# EasyEDA Pro project aoa_locator.eprj

# Schematic Schematic1

## Sheets
1 P1: Board Name: Board1; Create Date: 2025-01-06; Page Name: P1; Project Name: aoa_locator; Schematic Name: Schematic1; Update Date: 2025-02-27; Company: 嘉立创EDA; Page Size: A4; Version: V1.0
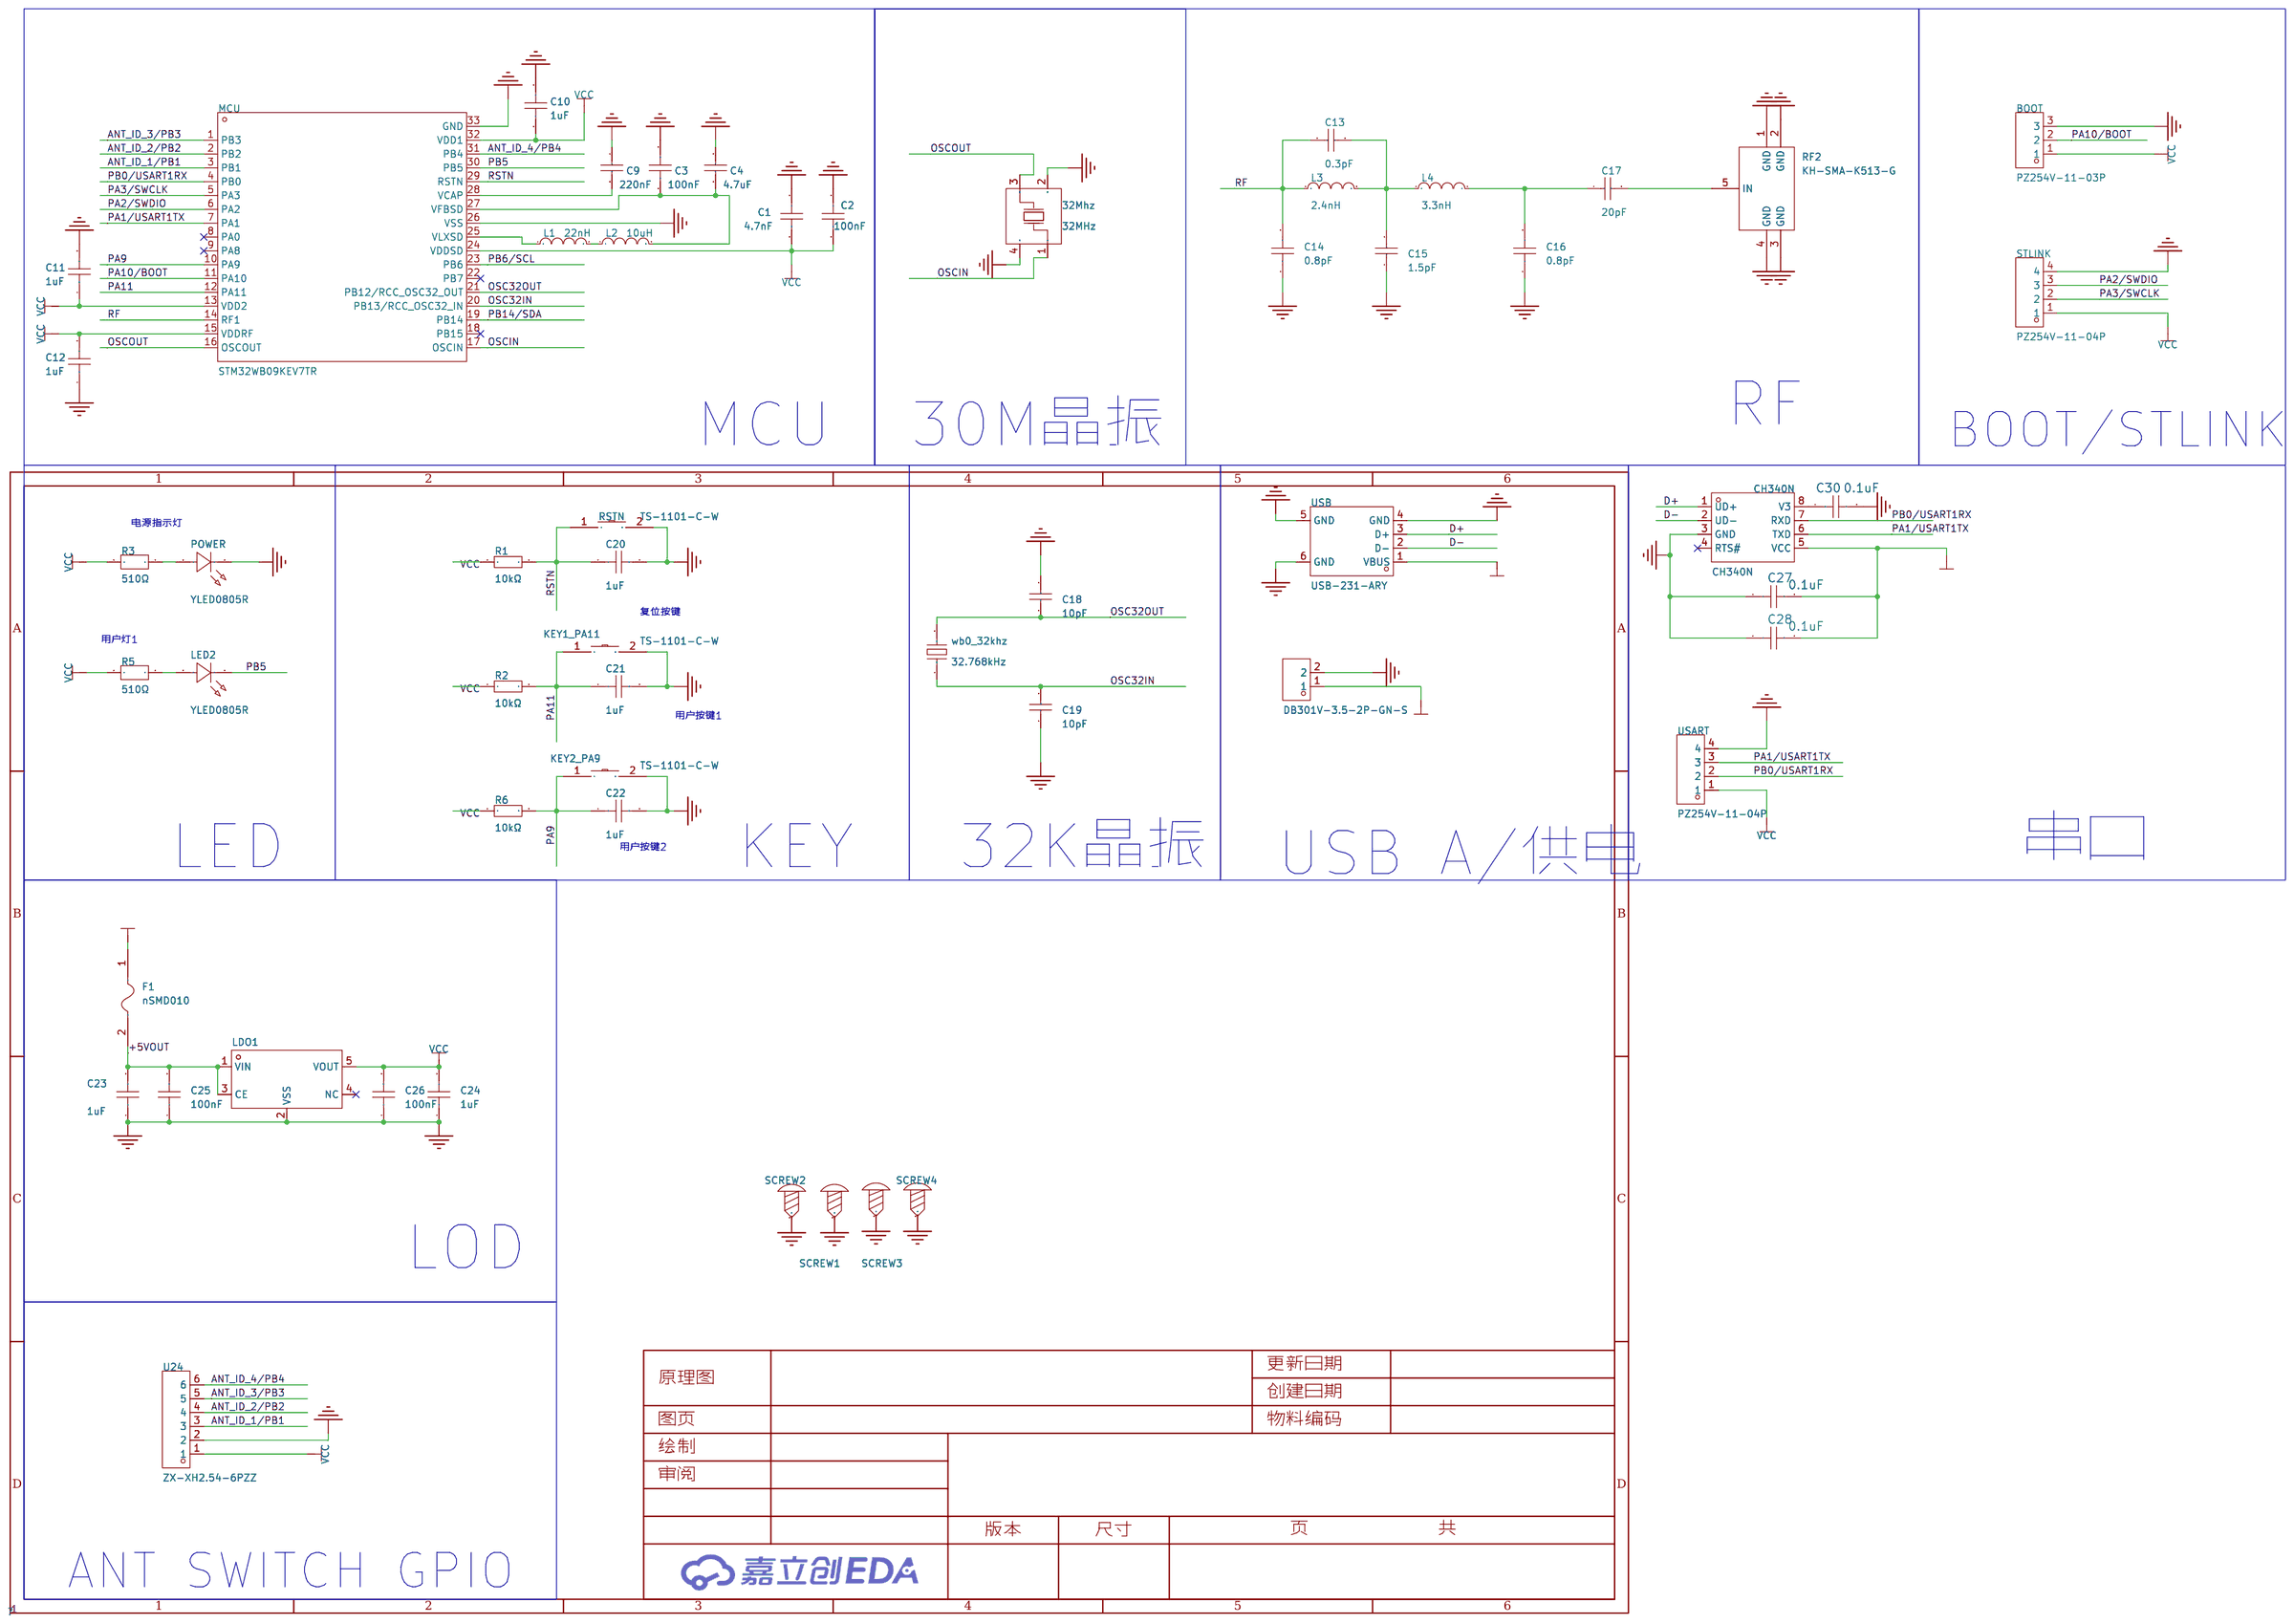
[diagram p0: P1]
2 P2: Create Date: 2025-01-22; Page Name: P2; Update Date: 2025-03-01
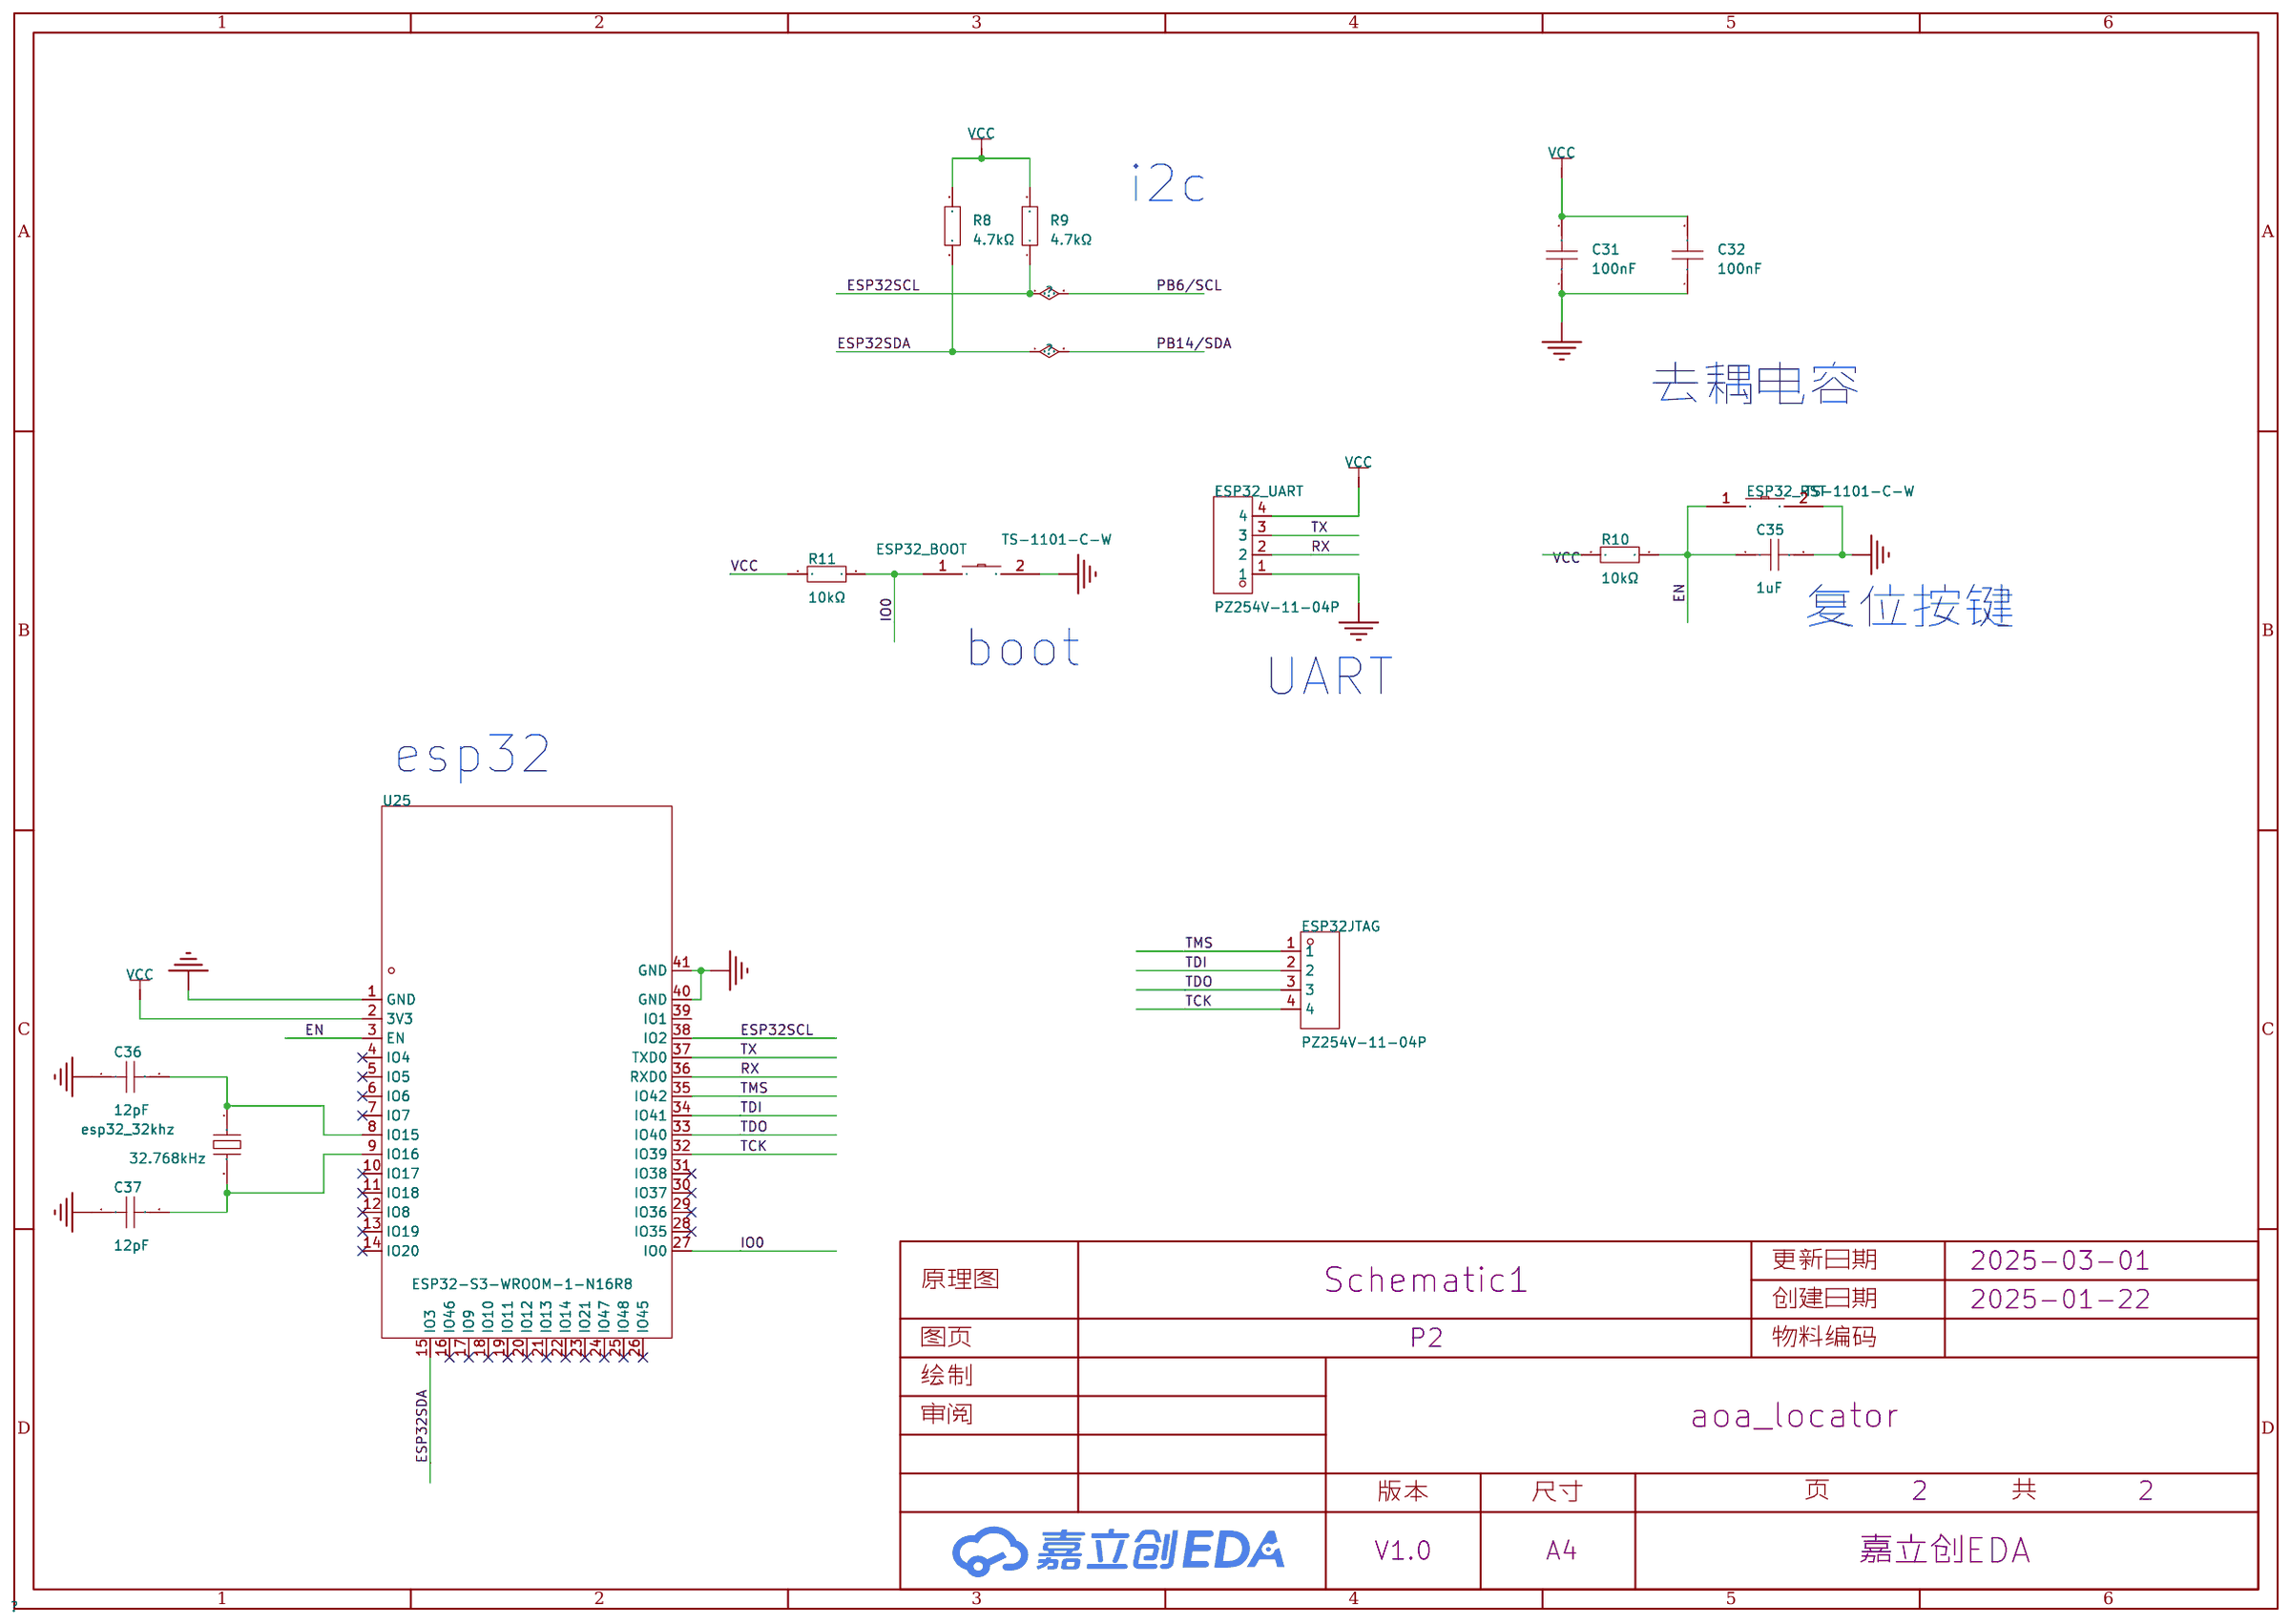
[diagram p1: P2]

## Parts
sheet P1
32Mhz  32MHz  [CRYSTAL-SMD_4P-L3.2-W2.5-BL]
BOOT  PZ254V-11-03P  [HDR-TH_3P-P2.54-V-M]
C1  4.7nF  [C0603]
C2  100nF  [C0603]
C3  100nF  [C0603]
C4  4.7uF  [C0603]
C9  220nF  [C0603]
C10  1uF  [C0603]
C11  1uF  [C0603]
C12  1uF  [C0603]
C13  0.3pF  [C0402]
C14  0.8pF  [C0402]
C15  1.5pF  [C0402]
C16  0.8pF  [C0402]
C17  20pF  [C0402]
C18  10pF  [C0603]
C19  10pF  [C0603]
C20  1uF  [C0603]
C21  1uF  [C0603]
C22  1uF  [C0603]
C23  1uF  [C0603]
C24  1uF  [C0603]
C25  100nF  [C0603]
C26  100nF  [C0603]
C27  0.1uF 0603  [C0603]
C28  0.1uF 0603  [C0603]
C30  0.1uF 0603  [C0603]
CH340N  CH340N  [SOP-8_L4.9-W3.9-P1.27-LS6.0-BL]
F1  nSMD010  [F1206]
KEY1_PA11  TS-1101-C-W  [SW-SMD_L6.0-W3.3-LS8.0]
KEY2_PA9  TS-1101-C-W  [SW-SMD_L6.0-W3.3-LS8.0]
L1  22nH  [IND-SMD_L1.6-W0.8-1]
L2  10uH  [L0805]
L3  2.4nH  [L0402]
L4  3.3nH  [L0402]
LDO1  ME6211C33M5G-N  [SOT-23-5_L3.0-W1.7-P0.95-LS2.8-BL]
LED2  YLED0805R  [LED0805-RD]
MCU  STM32WB09KEV7TR  [VFQFPN-32_L5.0-W5.0-P0.50-TL-EP3.7]
POWER  YLED0805R  [LED0805-RD]
R1  10kΩ  [R0603]
R2  10kΩ  [R0603]
R3  510Ω  [R0603]
R5  510Ω  [R0603]
R6  10kΩ  [R0603]
RF2  KH-SMA-K513-G  [ANT-TH_KH-SMA-K513-G]
RSTN  TS-1101-C-W  [SW-SMD_L6.0-W3.3-LS8.0]
SCREW1  -  [M2螺丝]
SCREW2  -  [M2螺丝]
SCREW3  -  [M2螺丝]
SCREW4  -  [M2螺丝]
STLINK  PZ254V-11-04P  [HDR-TH_4P-P2.54-V-M]
U23  DB301V-3.5-2P-GN-S  [CONN-TH_DB301V-3.5-2P-GN]
U24  ZX-XH2.54-6PZZ  [CONN-TH_6P-P2.50_ZX-XH2.54-6PZZ]
USART  PZ254V-11-04P  [HDR-TH_4P-P2.54-V-M]
USB  USB-231-ARY  [USB-A-TH_USB-231-ARY]
wb0_32khz  32.768kHz  [OSC-SMD_L3.2-W1.5]
sheet P2
C31  100nF  [C0603]
C32  100nF  [C0603]
C35  1uF  [C0603]
C36  12pF  [C0603]
C37  12pF  [C0603]
esp32_32khz  32.768kHz  [OSC-SMD_L3.2-W1.5]
ESP32_BOOT  TS-1101-C-W  [SW-SMD_L6.0-W3.3-LS8.0]
ESP32_RST  TS-1101-C-W  [SW-SMD_L6.0-W3.3-LS8.0]
ESP32_UART  PZ254V-11-04P  [HDR-TH_4P-P2.54-V-M]
ESP32JTAG  PZ254V-11-04P  [HDR-TH_4P-P2.54-V-M]
R8  4.7kΩ  [R0603]
R9  4.7kΩ  [R0603]
R10  10kΩ  [R0603]
R11  10kΩ  [R0603]
U25  ESP32-S3-WROOM-1-N16R8  [WIRELM-SMD_ESP32-S3-WROOM-1]

## Library data of the parts
32Mhz = X322532MOB4SI: 晶振类型:贴片晶振;频率:32MHz;常温频差:±10ppm;外接负载电容:12pF;频率稳定度(全温):±20ppm;; LCSC Part Name: 32MHz ±10ppm 12pF; Supplier Part: C9009; Manufacturer: YXC(扬兴晶振); Supplier Footprint: SMD3225-4P; JLCPCB Part Class: 扩展库; Datasheet: https://atta.szlcsc.com/upload/public/pdf/source/20240329/19D5F850207469550BEB00D7DFEDBC7A.pdf; Supplier: LCSC; Crystal Type: 贴片晶振; Normal temperature Frequency Tolerance: ±10ppm; External load capacitor: 12pF; Frequency Stability(Full temperature range): ±20ppm; Operating Temperature: -40℃~+85℃
BOOT = PZ254V-11-03P: 插针结构:1x3P;间距:2.54mm;行距:-;圆针/方针:方针;安装类型:直插;排数:单排;总PIN位数:3P;额定电流:3A;额定电压:250V;配合针长度:6mm;塑高:2.5mm;端接针长度:3mm;工作温度范围:-40℃~+105℃;颜色:黑色;; LCSC Part Name: 间距:2.54mm 1x3P 直插 方针; Supplier Part: C2937625; Manufacturer: XFCN(兴飞); Supplier Footprint: 插件,P=2.54mm; JLCPCB Part Class: 扩展库; Datasheet: https://atta.szlcsc.com/upload/public/pdf/source/20200309/C492402_8335C3D49C4E4C618838D59BB1D024C1.pdf; Supplier: LCSC; Pin Structure: 1x3P; Pitch: 2.54mm; Circluar Pins/Square Pins: 方针; Mounting Type: 直插; Number of Rows: 单排; Number of Pins: 3P; Current Rating (Max): 3A; Voltage Rating (Max): 250V; Length of Mating Pin: 6mm; Insulation Height: 2.5mm; Length of End Connection Pin: 3mm; Operating Temperature Range: -40℃~+105℃; Color: 黑色
C1 = CGA0603X7R472K500JT: 容值:4.7nF;精度:±10%;额定电压:50V;材质(温度系数):X7R;; LCSC Part Name: 4.7nF ±10% 50V; Supplier Part: C7503499; Manufacturer: HRE(芯声); Supplier Footprint: 0603; JLCPCB Part Class: 扩展库; Supplier: LCSC; Tolerance: ±10%; Voltage Rated: 50V; Temperature Coefficient: X7R
C2 C3 C25 C26 C31 C32 = CGA0603X7R104K500JT: 容值:100nF;精度:±10%;额定电压:50V;材质(温度系数):X7R;; LCSC Part Name: 100nF ±10% 50V; Supplier Part: C6119867; Manufacturer: HRE(芯声); Supplier Footprint: 0603; JLCPCB Part Class: 扩展库; Supplier: LCSC; Tolerance: ±10%; Voltage Rated: 50V; Temperature Coefficient: X7R
C4 = CL10A475KO8NNNC: 容值:4.7uF;精度:±10%;额定电压:16V;材质(温度系数):X5R;; LCSC Part Name: 4.7uF ±10% 16V; Supplier Part: C19666; Manufacturer: SAMSUNG(三星); Supplier Footprint: 0603; JLCPCB Part Class: 基础库; Datasheet: https://atta.szlcsc.com/upload/public/pdf/source/20160218/1457707763339.pdf; Supplier: LCSC; Tolerance: ±10%; Voltage Rated: 16V; Temperature Coefficient: X5R
C9 = CL10B224KA8NNNC: 容值:220nF;精度:±10%;额定电压:25V;材质(温度系数):X7R;; LCSC Part Name: 220nF ±10% 25V; Supplier Part: C21120; Manufacturer: SAMSUNG(三星); Supplier Footprint: 0603; JLCPCB Part Class: 基础库; Datasheet: https://atta.szlcsc.com/upload/public/pdf/source/20160218/1457707763339.pdf; Supplier: LCSC; Tolerance: ±10%; Voltage Rated: 25V; Temperature Coefficient: X7R
C10-C12 C23 C24 = CGA0603X5R105K160JT: 容值:1uF;精度:±10%;额定电压:16V;材质(温度系数):X5R;; LCSC Part Name: 1uF ±10% 16V; Supplier Part: C6119849; Manufacturer: HRE(芯声); Supplier Footprint: 0603; JLCPCB Part Class: 扩展库; Supplier: LCSC; Tolerance: ±10%; Voltage Rated: 16V; Temperature Coefficient: X5R
C13 = GJM1555C1HR30WB01D: 容值:0.3pF;额定电压:50V;材质(温度系数):C0G;; LCSC Part Name: 0.3pF 50V; Supplier Part: C76909; Manufacturer: muRata(村田); Supplier Footprint: 0402; JLCPCB Part Class: 扩展库; Datasheet: https://atta.szlcsc.com/upload/public/pdf/source/20180307/C76909_15204090774201407699.pdf; Supplier: LCSC; Voltage Rated: 50V; Temperature Coefficient: C0G
C14 C16 = GJM1555C1HR80WB01D: 容值:0.8pF;额定电压:50V;材质(温度系数):C0G;; LCSC Part Name: 0.8pF 50V; Supplier Part: C88902; Manufacturer: muRata(村田); Supplier Footprint: 0402; JLCPCB Part Class: 扩展库; Datasheet: https://atta.szlcsc.com/upload/public/pdf/source/20190904/C426118_85E81C7C1F21FC87C5FB6D536E0847B4.pdf; Supplier: LCSC; Voltage Rated: 50V; Temperature Coefficient: C0G
C15 = GJM1555C1H1R5WB01D: 容值:1.5pF;额定电压:50V;材质(温度系数):-;; LCSC Part Name: 1.5pF 50V; Supplier Part: C76901; Manufacturer: muRata(村田); Supplier Footprint: 0402; JLCPCB Part Class: 扩展库; Datasheet: https://atta.szlcsc.com/upload/public/pdf/source/20180326/C76901_35AAC13796FF1C4F89C7FD46F40EAEE1.pdf; Supplier: LCSC; Voltage Rated: 50V
C17 = 0402CG200J500NT: 容值:20pF;精度:±5%;额定电压:50V;材质(温度系数):C0G;; LCSC Part Name: 20pF ±5% 50V; Supplier Part: C1554; Manufacturer: FH(风华); Supplier Footprint: 0402; JLCPCB Part Class: 基础库; Datasheet: https://atta.szlcsc.com/upload/public/pdf/source/20200305/C486355_26A10D38EF8C2A5C37091D0039909270.pdf; Supplier: LCSC; Tolerance: ±5%; Voltage Rated: 50V; Temperature Coefficient: C0G
C18 C19 = CC0603JRNPO9BN100: 容值:10pF;精度:±5%;额定电压:50V;材质(温度系数):NP0;; LCSC Part Name: 10pF ±5% 50V; Supplier Part: C106245; Manufacturer: YAGEO(国巨); Supplier Footprint: 0603; JLCPCB Part Class: 扩展库; Datasheet: https://atta.szlcsc.com/upload/public/pdf/source/20170505/1493957838062.pdf; Supplier: LCSC; Tolerance: ±5%; Voltage Rated: 50V; Temperature Coefficient: NP0
C20-C22 C35 = CL10A105KB8NNNC: LCSC Part Name: 1uF ±10% 50V; Supplier Part: C15849; Manufacturer: SAMSUNG(三星); Supplier Footprint: 0603; JLCPCB Part Class: 基础库; Datasheet: https://atta.szlcsc.com/upload/public/pdf/source/20160218/1457707763339.pdf; Supplier: LCSC; Tolerance: ±10%; Voltage Rated: 50V; Temperature Coefficient: X5R
C27 C28 C30 = CC0603JRNPO9BN101: 容值:100pF;精度:±5%;额定电压:50V;材质(温度系数):NP0;; LCSC Part Name: 100pF ±5% 50V; Supplier Part: C14665; Manufacturer: YAGEO(国巨); Supplier Footprint: 0603; JLCPCB Part Class: 扩展库; Datasheet: https://atta.szlcsc.com/upload/public/pdf/source/20181008/C309499_21CC21451B82C39E3D92150FD6B30293.pdf; Supplier: LCSC; Tolerance: ±5%; Voltage Rated: 50V; Temperature Coefficient: NP0
CH340N = CH340N: LCSC Part Name: USB转串口芯片 CH340; Supplier Part: C2977777; Manufacturer: WCH(南京沁恒); Supplier Footprint: SOP-8; JLCPCB Part Class: 扩展库; Datasheet: https://atta.szlcsc.com/upload/public/pdf/source/20230530/6E401E9554E9F5311886CC8B3F89B62E.pdf; Supplier: LCSC
F1 = nSMD010: 最大电压:60V;最大电流:40A;保持电流:100mA;跳闸电流:250mA;; LCSC Part Name: 0.10A 60V 自恢复保险丝; Supplier Part: C70065; Manufacturer: 台湾陆海; Supplier Footprint: 1206; JLCPCB Part Class: 扩展库; Datasheet: https://atta.szlcsc.com/upload/public/pdf/source/20230404/ADB19886462D98F83AD677B1F8114E76.pdf; Supplier: LCSC; Operating Voltage (Max): 60V; Current Rating (Max): 40A; Hold Current: 100mA; Trip Current: 250mA; Power Dissipation: -；-；-；-; Operating Temperature: -40℃~+85℃
ESP32_BOOT ESP32_RST KEY1_PA11 KEY2_PA9 RSTN = TS-1101-C-W: 电路结构:单刀单掷;按钮形状:矩形按钮;作用力:260gf;安装方式:立贴;开关长度:6mm;开关宽度:3.6mm;开关高度:2.5mm;带支架:不带;触点电流:50mA;额定电压(AC):-;额定电压(DC):12V;额定功率:-;绝缘电阻:-;带灯:无;机械寿命:5万次;; LCSC Part Name: 6*3.6*2.5mm 立贴 轻触开关; Supplier Part: C318938; Manufacturer: XKB Connectivity(中国星坤); Supplier Footprint: SMD; JLCPCB Part Class: 扩展库; Datasheet: https://atta.szlcsc.com/upload/public/pdf/source/20200227/C318938_C2E53B1EEDE37D980A33616AC086DE53.pdf; Supplier: LCSC; Circuit: 单刀单掷; Actuator Style: 矩形按钮; Operating Force: 260gf; Mounting Style: 立贴; Switch Length: 6mm; Switch Width: 3.6mm; Switch Height: 2.5mm; Strike Gundam: 不带; Contact Current: 50mA; Voltage Rating (DC): 12V; Actuator/Cap Color: 白色带淡绿; With Lamp: 无; Mechanical Life: 5万次; Operating Temperature: -30℃~+85℃
L1 = LQW18AN22NG10D: 电感值:22nH;精度:±2%;额定电流:640mA;饱和电流(Isat):-;; LCSC Part Name: 22nH ±2%; Supplier Part: C162643; Manufacturer: muRata(村田); Supplier Footprint: 0603; JLCPCB Part Class: 扩展库; Datasheet: https://atta.szlcsc.com/upload/public/pdf/source/20180509/C162643_85EF45ECB5B52277646B8D922D19C79B.pdf; Supplier: LCSC; Tolerance: ±2%; Rated Current: 640mA; DC Resistance (DCR): 99mΩ
L2 = MGFL2012F100MT-LF: 电感值:10uH;精度:±20%;额定电流:500mA;饱和电流(Isat):-;直流电阻(DCR):320mΩ;; LCSC Part Name: 10uH ±20%; Supplier Part: C281113; Manufacturer: microgate(麦捷科技); Supplier Footprint: 0805; JLCPCB Part Class: 扩展库; Datasheet: https://atta.szlcsc.com/upload/public/pdf/source/20181025/C281113_18633E3AF8F2E9832A865B8532475DE8.pdf; Supplier: LCSC; Tolerance: ±20%; Rated Current: 500mA; DC Resistance (DCR): 320mΩ
L3 = LQW15AN2N4C00D: 电感值:2.4nH;额定电流:850mA;饱和电流(Isat):-;; Supplier Part: C167473; Manufacturer: muRata(村田); Supplier Footprint: 0402; JLCPCB Part Class: 扩展库; Datasheet: https://atta.szlcsc.com/upload/public/pdf/source/20191016/C437364_463D6516B3BAE72B1DA0754F3D9B8308.pdf; Supplier: LCSC; Rated Current: 850mA; DC Resistance (DCR): 50mΩ
L4 = LQG15HS3N3B02D: 电感值:3.3nH;精度:-;额定电流:800mA;饱和电流(Isat):-;直流电阻(DCR):125mΩ;; Supplier Part: C162542; Manufacturer: muRata(村田); Supplier Footprint: 0402; JLCPCB Part Class: 扩展库; Datasheet: https://atta.szlcsc.com/upload/public/pdf/source/20190301/C337910_27DA25781C95F885577870A93A746ADF.pdf; Supplier: LCSC; Rated Current: 800mA; DC Resistance (DCR): 125mΩ; Q @ Freq: 8@100MHz; Frequency - Self Resonant: 6GHz
LDO1 = ME6211C33M5G-N: 输出类型:固定;输出极性:正;最大输入电压:6V;输出电压:3.3V;输出电流:500mA;电源纹波抑制比(PSRR):70dB;; Supplier Part: C82942; Manufacturer: MICRONE(南京微盟); Supplier Footprint: SOT-23-5; JLCPCB Part Class: 扩展库; Datasheet: https://atta.szlcsc.com/upload/public/pdf/source/20170918/C82942_1505727073070976520.pdf; Supplier: LCSC; Output Type: 固定; Output Polarity: 正; Number of Outputs: 1; Maximum Input Voltage: 6V; Output Voltage: 3.3V; Dropout Voltage: 260mV@(200mA); Output Current: 500mA; Power Supply Rejection Ratio (PSRR): 70dB
LED2 POWER = YLED0805R: 发光颜色:红色;正向电压(VF):1.8V~2.4V;功率:60mW;正向电流:20mA;主波长:615nm~630nm;二极管配置:-;透镜颜色:-;色温:-;发光强度:-;发光角度:-;载带方式:-;工作温度:-40℃~+85℃;; Supplier Part: C19171391; Manufacturer: YONGYUTAI(永裕泰); Supplier Footprint: 0805; JLCPCB Part Class: 扩展库; Datasheet: https://atta.szlcsc.com/upload/public/pdf/source/20231027/AB486D22E6D71BC59190C48A798367E6.pdf; Supplier: LCSC; Emitted Color: 红色; Forward Voltage (VF): 1.8V~2.4V; Power Dissipation: 60mW; Forward Current: 20mA; Dominant Wavelength: 615nm~630nm; Peak Wavelength: 645nm; Operating Temperature: -40℃~+85℃
MCU = STM32WB09KEV7TR: Supplier Part: C25810068; Manufacturer: ST(意法半导体); Supplier Footprint: VFQFPN-32(5x5); JLCPCB Part Class: 扩展库; Datasheet: https://atta.szlcsc.com/upload/public/pdf/source/20241226/A485BCC7A2E17B8AF02A91B2E41BFE32.pdf; Supplier: LCSC
R1 R2 R6 R10 R11 = 0603WAF1002T5E: LCSC Part Name: 厚膜电阻 10kΩ ±1% 100mW; Supplier Part: C25804; Manufacturer: UNI-ROYAL(厚声); Supplier Footprint: 0603; JLCPCB Part Class: 基础库; Datasheet: https://atta.szlcsc.com/upload/public/pdf/source/20200306/C422600_1E6D84923E4A46A82E41ADD87F860B5C.pdf; Supplier: LCSC; Type: 厚膜电阻; Tolerance: ±1%; Power(Watts): 100mW; Overload Voltage (Max): 75V; Temperature Coefficient: ±100ppm/℃; Operating Temperature Range: -55℃~+155℃
R3 R5 = FRC0603J511 TS: 电阻类型:厚膜电阻;阻值:510Ω;精度:±5%;功率:100mW;最大工作电压:75V;温度系数:±100ppm/℃;; LCSC Part Name: 510Ω ±5% 100mW 厚膜电阻; Supplier Part: C2907179; Manufacturer: FOJAN(富捷); Supplier Footprint: 0603; JLCPCB Part Class: 扩展库; Datasheet: https://atta.szlcsc.com/upload/public/pdf/source/20211221/925EC7D7225764EE0046F22065062C87.pdf; Supplier: LCSC; Type: 厚膜电阻; Tolerance: ±5%; Power(Watts): 100mW; Overload Voltage (Max): 75V; Temperature Coefficient: ±100ppm/℃; Operating Temperature Range: -55℃~+155℃
RF2 = KH-SMA-K513-G: 连接器类型:板端;接口类型:内孔;端口数量:1;接口直径:-;接口长度/高度:-;频率-最大值:6GHz;射频系列:SMA;阻抗:50Ω;样式:弯头;工作温度范围:-55℃~+155℃;; LCSC Part Name: SMA 内孔 弯头; Supplier Part: C411575; Manufacturer: kinghelm(金航标); Supplier Footprint: 插件; JLCPCB Part Class: 扩展库; Datasheet: https://atta.szlcsc.com/upload/public/pdf/source/20210317/C411575_49039CD64129040639EC5218E5A2C783.pdf; Supplier: LCSC; Connector Type: 板端; Interface Type: 内孔; Number of Ports: 1; Frequency-Max: 6GHz; RF Series: SMA; Impedance: 50Ω; Style: 弯头; Operating Temperature Range: -55℃~+155℃
SCREW1-SCREW4 = M2螺丝: Supplier Footprint: 插件
ESP32_UART ESP32JTAG STLINK USART = PZ254V-11-04P: 插针结构:1x4P;间距:2.54mm;行距:-;圆针/方针:方针;安装类型:直插;排数:单排;总PIN位数:4P;额定电流:3A;额定电压:250V;配合针长度:6mm;塑高:2.5mm;端接针长度:3mm;触头材质:-;工作温度范围:-40℃~+105℃;颜色:黑色;; LCSC Part Name: 间距:2.54mm 1x4P 直插 方针; Supplier Part: C2691448; Manufacturer: XFCN(兴飞); Supplier Footprint: 插件,P=2.54mm; JLCPCB Part Class: 扩展库; Datasheet: https://atta.szlcsc.com/upload/public/pdf/source/20200309/C492403_F9F19131791D08044AD4F84F8E751A34.pdf; Supplier: LCSC; Pin Structure: 1x4P; Pitch: 2.54mm; Circluar Pins/Square Pins: 方针; Mounting Type: 直插; Number of Rows: 单排; Number of Pins: 4P; Current Rating (Max): 3A; Voltage Rating (Max): 250V; Length of Mating Pin: 6mm; Insulation Height: 2.5mm; Length of End Connection Pin: 3mm; Operating Temperature Range: -40℃~+105℃; Color: 黑色
U23 = DB301V-3.5-2P-GN-S: 结构:1x2P;间距:3.5mm;颜色:绿色;安装方式:直插;额定电流:10A;额定电压:130V;排数:1;线规 - AWG:18~24;线规 - 平方毫米:0.5~1;每排PIN数:2;工作温度范围:-40℃~+105℃;; LCSC Part Name: 3.5mm 1x2P 排数:1 每排P数:2 直插; Supplier Part: C695629; Manufacturer: DORABO(地博电气); Supplier Footprint: 插件,P=3.5mm; JLCPCB Part Class: 扩展库; Datasheet: https://atta.szlcsc.com/upload/public/pdf/source/20230106/1B95616A85A883CA085E21635C8A8490.pdf; Supplier: LCSC; Structure: 1x2P; Pitch: 3.5mm; Color: 绿色; Mounting Style: 直插; Current Rating (Max): 10A; Voltage Rating (Max): 130V; Number of Pins: 2P; Number of Rows: 1; Wire Gauge - AWG: 18~24; Wire Gauge - mm2: 0.5~1; Number of PINs Per Row: 2; Operating Temperature Range: -40℃~+105℃
U24 = ZX-XH2.54-6PZZ: LCSC Part Name: 1x6P 间距:2.5mm 直插 系列:XH; Supplier Part: C7429636; Manufacturer: Megastar(兆星); Supplier Footprint: 插件,P=2.5mm; JLCPCB Part Class: 扩展库; Datasheet: https://atta.szlcsc.com/upload/public/pdf/source/20230619/1243AD0A516E39CD3D274D8985780568.pdf; Supplier: LCSC; Pins Structure: 1x6P; Pitch: 2.5mm; Mounting Type: 直插; Reference Series: XH; Number of Pins: 6P; Number of Rows: 1; Number of PINs Per Row: 6; Rated Current: 3A; Contact Material: 黄铜; Contact Plating: 锡; Operating Temperature: -25℃~+85℃; Rated Voltage (Max): 250V; Plastic Material: PA66; Flame Retardant Rating: UL94V-0; Color: 白色; Z-Height of the Board: 7mm; X-Length of Bottom Edge on Board (Spacing Line): 17.5mm; Y-Width of Bottom Edge on Board: 5.9mm
USB = USB-231-ARY: LCSC Part Name: Type-A 母 弯插; Supplier Part: C720525; Manufacturer: XUNPU(讯普); Supplier Footprint: 插件; JLCPCB Part Class: 扩展库; Datasheet: https://atta.szlcsc.com/upload/public/pdf/source/20200810/C720525_A4C9C15D608FF9239C9C137FD959DB52.pdf; Supplier: LCSC; Connector Type: Type-A; Standard: USB 2.0; Gender: 母; Number of Ports: 1; Number of Contacts: 4P; Mounting Style: 弯插; Current Rating - Power (Max): 1.5A; Operating Temperature Range: -20℃~+70℃; Soldering Temperature(Max): 260℃
esp32_32khz wb0_32khz = X321532768KGD2SI: 晶振类型:贴片晶振;频率:32.768kHz;常温频差:±20ppm;外接负载电容:12.5pF;频率稳定度(全温):-;; LCSC Part Name: 32.768kHz ±20ppm 12.5pF; Supplier Part: C620155; Manufacturer: YXC(扬兴晶振); Supplier Footprint: SMD3215-2P; JLCPCB Part Class: 扩展库; Datasheet: https://atta.szlcsc.com/upload/public/pdf/source/20240329/3A7650FD985DD0DE85694D3785AB4916.pdf; Supplier: LCSC; Crystal Type: 贴片晶振; Normal temperature Frequency Tolerance: ±20ppm; External load capacitor: 12.5pF; Operating Temperature: -40℃~+85℃
C36 C37 = CAP_0603: Supplier Footprint: 0603
R8 R9 = 0603WAF4701T5E: LCSC Part Name: 4.7kΩ ±1% 100mW 厚膜电阻; Supplier Part: C23162; Manufacturer: UNI-ROYAL(厚声); Supplier Footprint: 0603; JLCPCB Part Class: 基础库; Datasheet: https://atta.szlcsc.com/upload/public/pdf/source/20200306/C422600_1E6D84923E4A46A82E41ADD87F860B5C.pdf; Supplier: LCSC; Type: 厚膜电阻; Tolerance: ±1%; Power(Watts): 100mW; Overload Voltage (Max): 75V; Temperature Coefficient: ±100ppm/℃; Operating Temperature Range: -55℃~+155℃
U25 = ESP32-S3-WROOM-1-N16R8: LCSC Part Name: 通用型Wi-Fi+低功耗蓝牙MCU模组; Supplier Part: C2913202; Manufacturer: ESPRESSIF(乐鑫); Supplier Footprint: SMD,18x25.5mm; JLCPCB Part Class: 扩展库; Datasheet: https://atta.szlcsc.com/upload/public/pdf/source/20220705/4E799F39581577F766659887F738A439.pdf; Supplier: LCSC

## Nets
+5VIN: C27.2 C28.2 CH340N.5(VCC) F1.1 U23.1 USB.1(VBUS)
+5VOUT: C23.2 C25.2 F1.2 LDO1.1(VIN) LDO1.3(CE)
GND: 32Mhz.2(GND) 32Mhz.4(GND) BOOT.3 C1.1 C2.1 C3.1 C4.2 C9.1 C10.1 C11.2 C12.1 C14.1 C15.1 C16.1 C18.2 C19.1 C20.2 C21.2 C22.2 C23.1 C24.1 C25.1 C26.1 C27.1 C28.1 C30.2 C31.1 C32.1 C35.2 C36.1 C37.1 CH340N.3(GND) ESP32_BOOT.2 ESP32_RST.2 ESP32_UART.1 KEY1_PA11.2 KEY2_PA9.2 LDO1.2(VSS) MCU.26(VSS) MCU.33(GND) POWER.1(K) RF2.1(GND) RF2.2(GND) RF2.3(GND) RF2.4(GND) RSTN.2 SCREW1.1 SCREW2.1 SCREW3.1 SCREW4.1 STLINK.4 U23.2 U24.2 U25.1(GND) U25.40(GND) U25.41(GND) USART.4 USB.4(GND) USB.5(GND) USB.6(GND)
VCC: BOOT.1 C1.2 C2.2 C10.2 C11.1 C12.2 C24.2 C26.2 C31.2 C32.2 ESP32_UART.4 LDO1.5(VOUT) MCU.13(VDD2) MCU.15(VDDRF) MCU.24(VDDSD) MCU.32(VDD1) R1.1 R2.1 R3.2 R5.1 R6.1 R8.2 R9.2 R10.1 R11.1 STLINK.1 U24.1 U25.2(3V3) USART.1
ANT_ID_1/PB1: MCU.3(PB1) U24.3
ANT_ID_2/PB2: MCU.2(PB2) U24.4
ANT_ID_3/PB3: MCU.1(PB3) U24.5
ANT_ID_4/PB4: MCU.31(PB4) U24.6
D+: CH340N.1(UD+) USB.3(D+)
D-: CH340N.2(UD-) USB.2(D-)
EN: C35.1 ESP32_RST.1 R10.2 U25.3(EN)
ESP32SCL: MCU.23(PB6) R9.1 U25.38(IO2)
ESP32SDA: MCU.19(PB14) R8.1 U25.15(IO3)
IO0: ESP32_BOOT.1 R11.2 U25.27(IO0)
OSC32IN: C19.2 MCU.20(PB13/RCC_OSC32_IN) wb0_32khz.1
OSC32OUT: C18.1 MCU.21(PB12/RCC_OSC32_OUT) wb0_32khz.2
OSCIN: 32Mhz.1(OSC1) MCU.17(OSCIN)
OSCOUT: 32Mhz.3(OSC2) MCU.16(OSCOUT)
PA1/USART1TX: CH340N.6(TXD) MCU.7(PA1) USART.3
PA2/SWDIO: MCU.6(PA2) STLINK.3
PA3/SWCLK: MCU.5(PA3) STLINK.2
PA9: C22.1 KEY2_PA9.1 MCU.10(PA9) R6.2
PA10/BOOT: BOOT.2 MCU.11(PA10)
PA11: C21.1 KEY1_PA11.1 MCU.12(PA11) R2.2
PB0/USART1RX: CH340N.7(RXD) MCU.4(PB0) USART.2
PB5: LED2.1(K) MCU.30(PB5)
RF: C13.1 C14.2 L3.1 MCU.14(RF1)
RSTN: C20.1 MCU.29(RSTN) R1.2 RSTN.1
RX: ESP32_UART.2 U25.36(RXD0)
TCK: ESP32JTAG.4 U25.32(IO39)
TDI: ESP32JTAG.2 U25.34(IO41)
TDO: ESP32JTAG.3 U25.33(IO40)
TMS: ESP32JTAG.1 U25.35(IO42)
TX: ESP32_UART.3 U25.37(TXD0)
$1N1158: C3.2 C4.1 L2.2 MCU.27(VFBSD)
$1N1170: L1.2 L2.1
$1N1172: L1.1 MCU.25(VLXSD)
$1N1239: C9.2 MCU.28(VCAP)
$1N2129: C16.2 C17.1 L4.2
$1N2134: C13.2 C15.2 L3.2 L4.1
$1N2136: C17.2 RF2.5(IN)
$1N2700: POWER.2(A) R3.1
$1N5752: C30.1 CH340N.8(V3)
$2N5390: C37.2 esp32_32khz.2 U25.9(IO16)
$2N5391: C36.2 esp32_32khz.1 U25.8(IO15)
Net-(LED2-2): LED2.2(A) R5.2

Not connected (* = marked no-connect by the designer): CH340N 4(RTS#)*; LDO1 4(NC)*; MCU 8(PA0)* 9(PA8)* 18(PB15)* 22(PB7)*; U25 4(IO4)* 5(IO5)* 6(IO6)* 7(IO7)* 10(IO17)* 11(IO18)* 12(IO8)* 13(IO19)* 14(IO20)* 16(IO46)* 17(IO9)* 18(IO10)* 19(IO11)* 20(IO12)* 21(IO13)* 22(IO14)* 23(IO21)* 24(IO47)* 25(IO48)* 26(IO45)* 28(IO35)* 29(IO36)* 30(IO37)* 31(IO38)* 39(IO1)

## Notes on the sheets
sheet 1
- RF
- MCU
- 30M晶振
- BOOT/STLINK
- 电源指示灯
- 复位按键
- 用户灯1
- 用户按键1
- 用户按键2
- 串口
- LED
- KEY
- 32K晶振
- USB A/供电
- LOD
- ANT SWITCH GPIO
sheet 2
- i2c
- 去耦电容
- 复位按键
- boot
- UART
- esp32

# Board PCB1
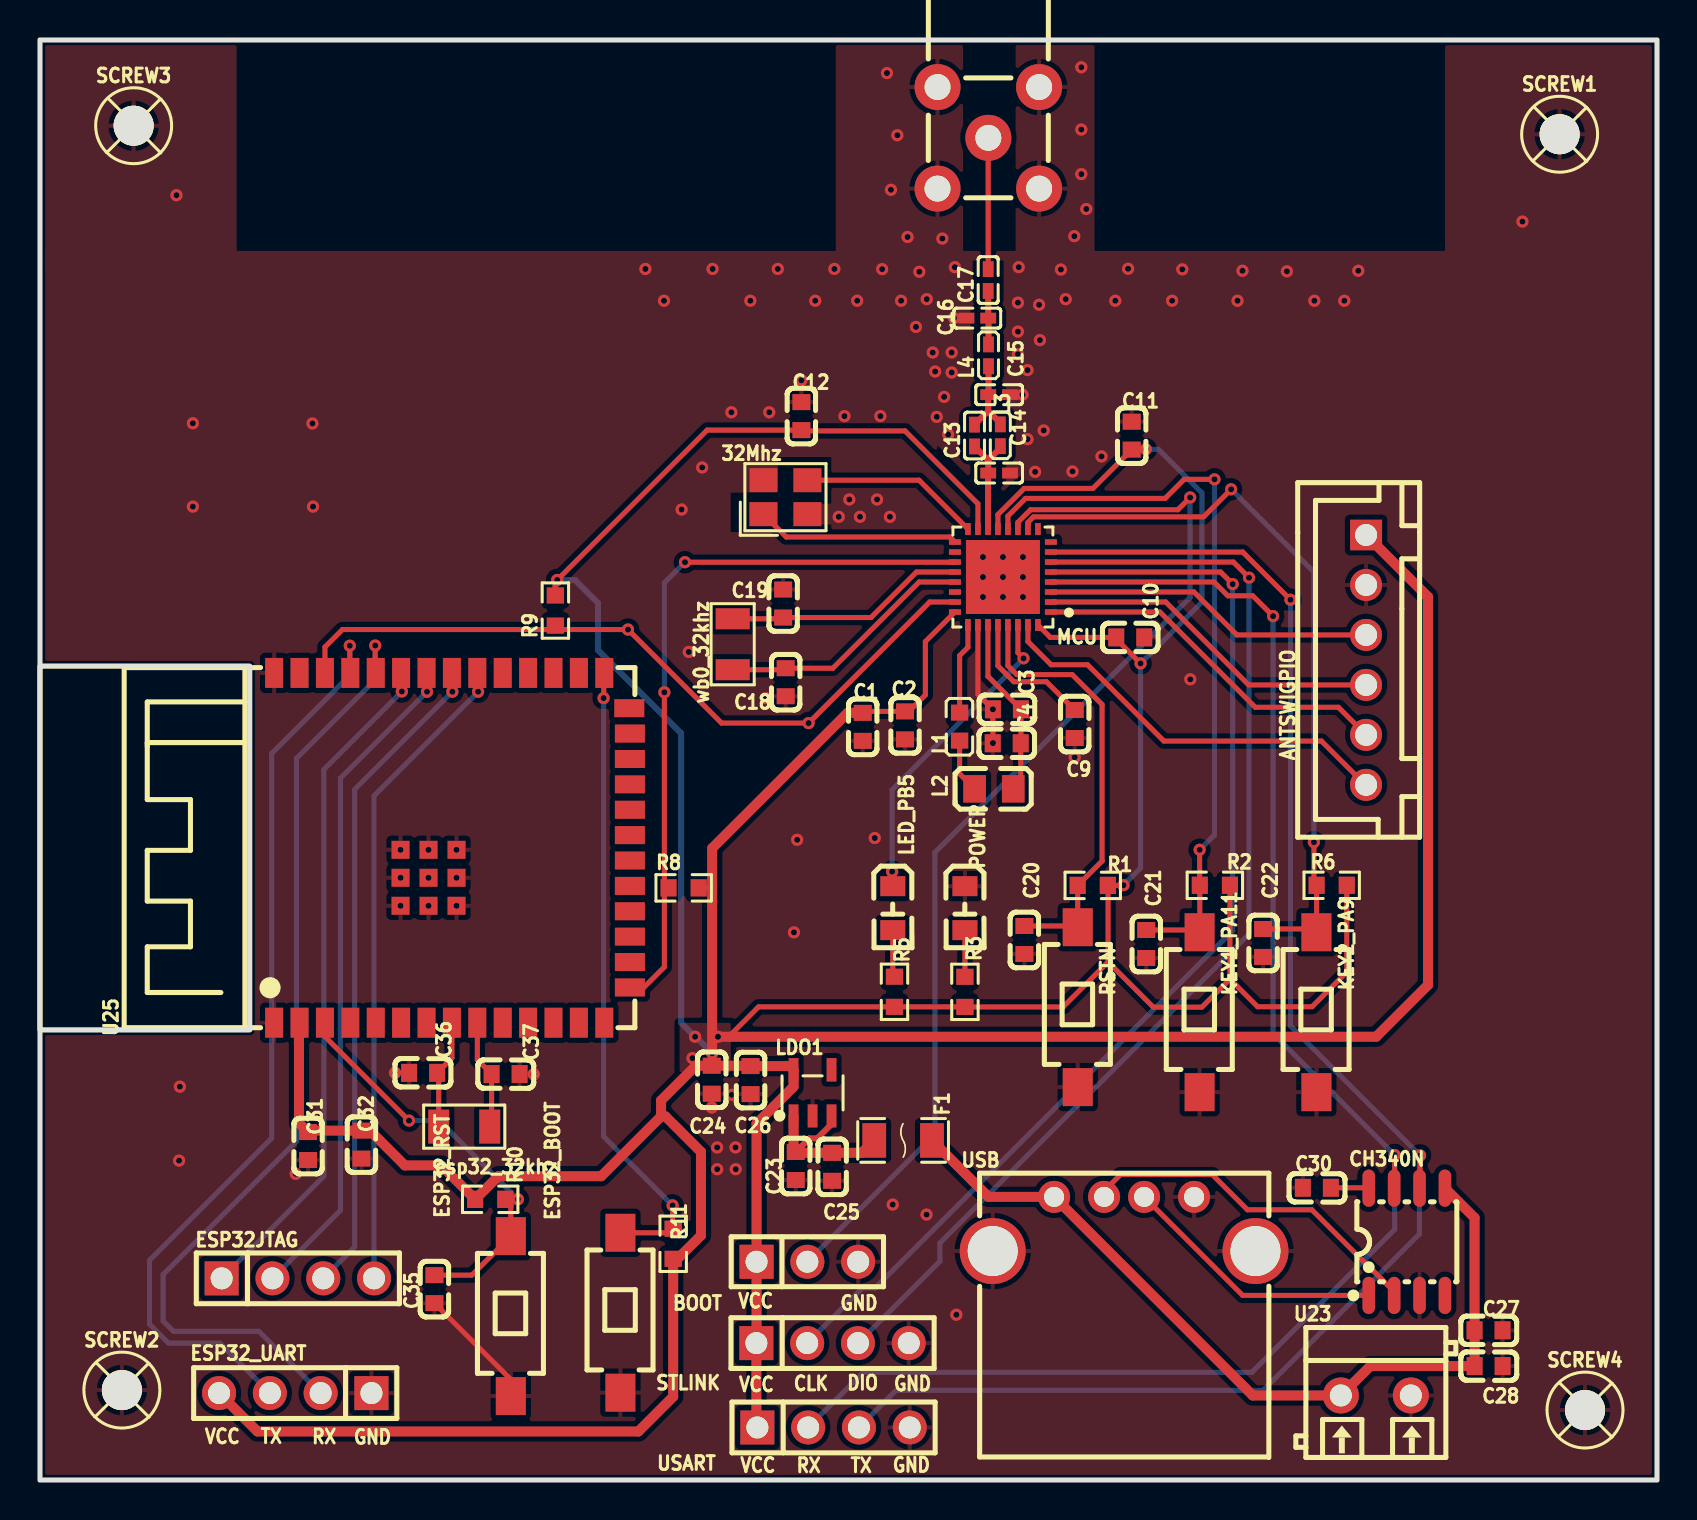
[diagram p2: board, top side]
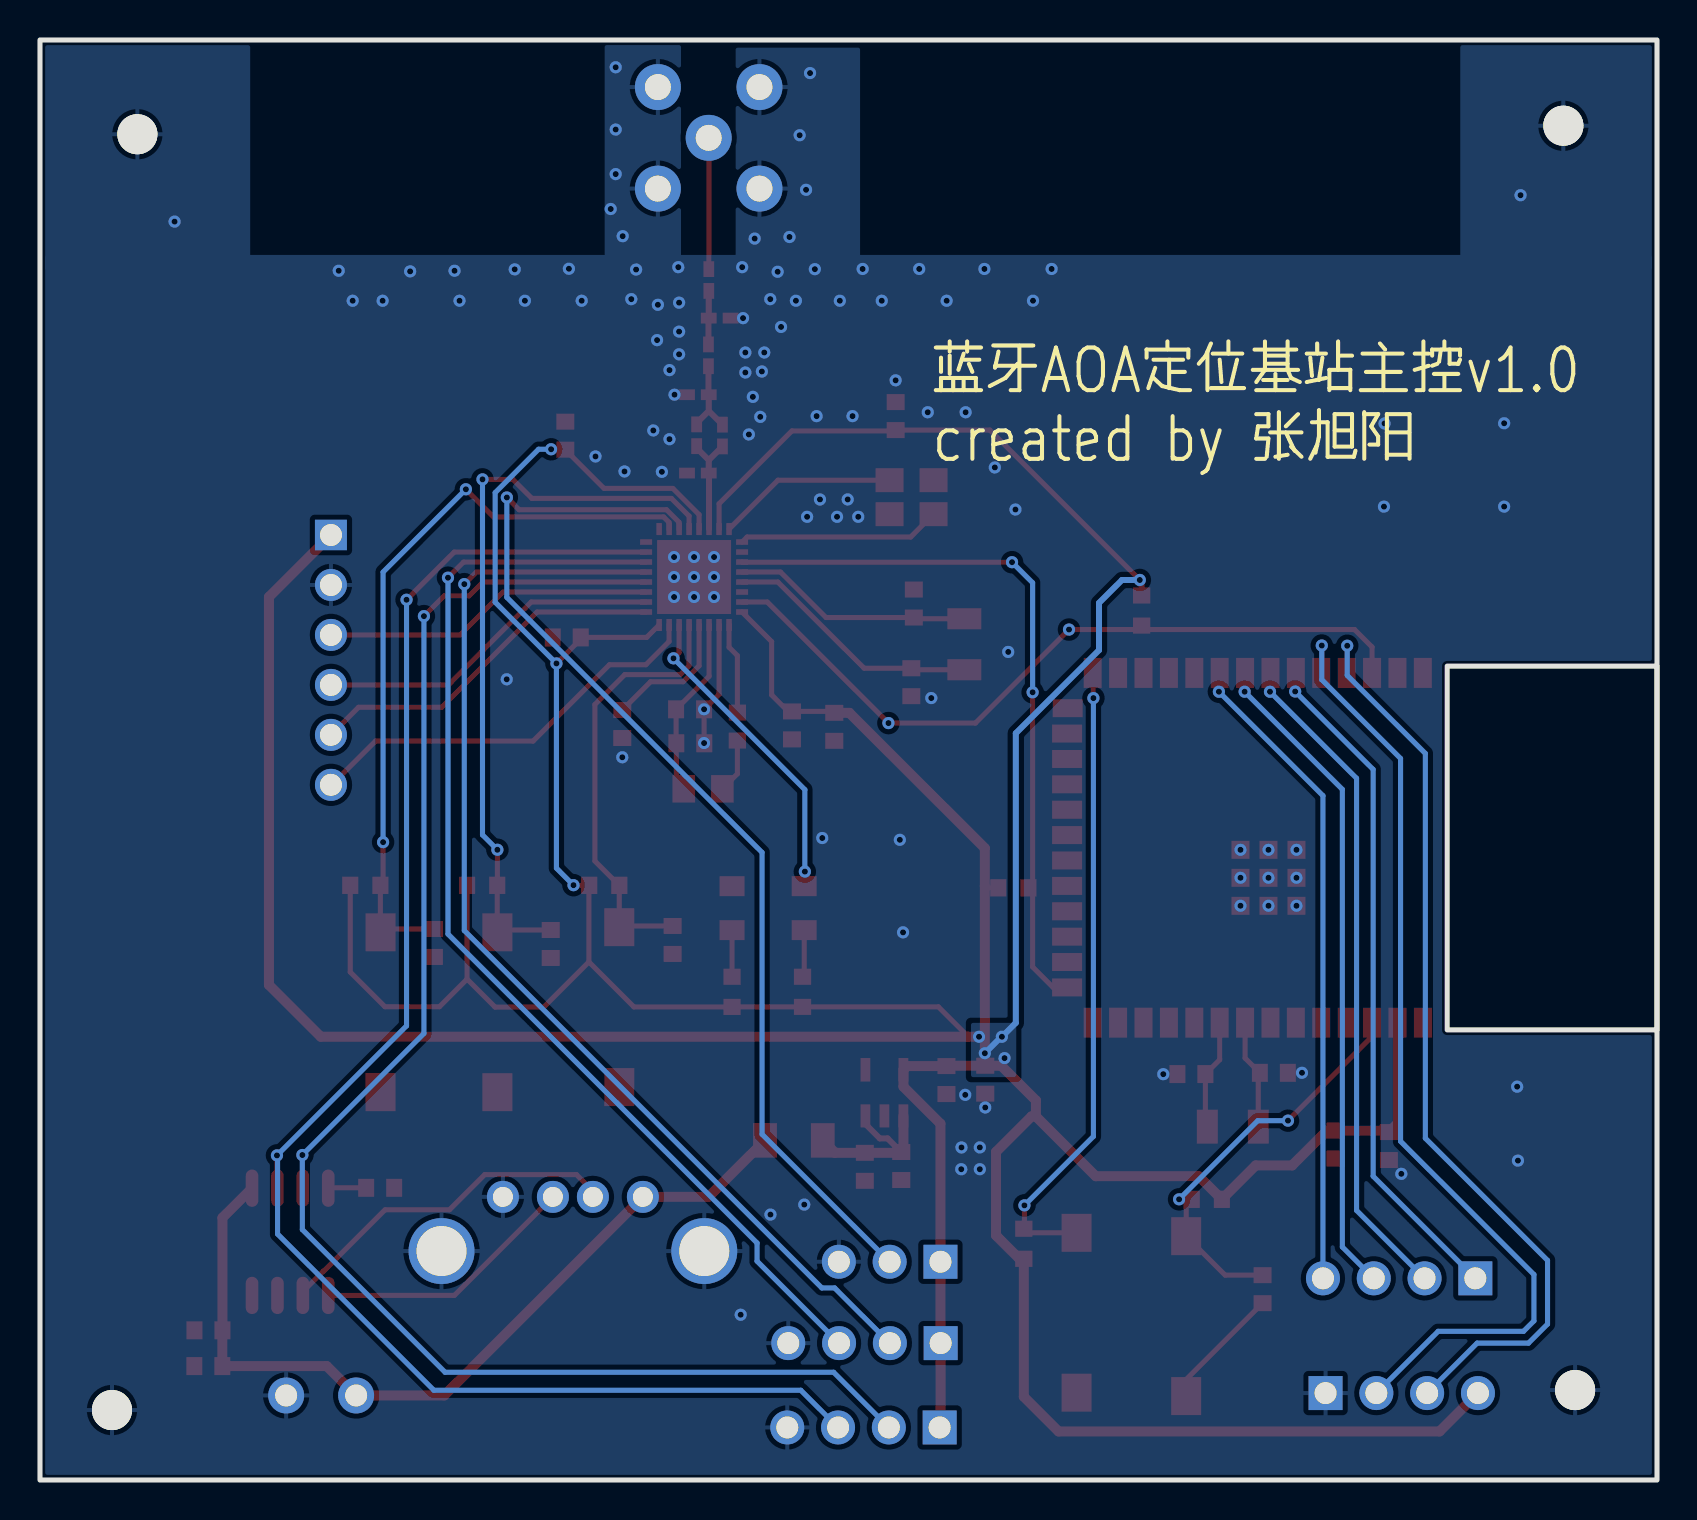
[diagram p3: board, bottom side, seen from below]

Outline 80.87 x 72.05 mm; copper layers: Top Layer, Bottom Layer. Coordinates in mm from the lower left corner of the outline.
Outline path: rectangle 0,72.05 80.87,0 ; rectangle 0,40.72 10.49,22.52
Stack: Top Layer 0.035mm / Dielectric1 1.51mm FR4 er 4.5 / Bottom Layer 0.035mm

## Design rules (mm)
template: 自定义配置
spacing copperThickness1oz (default): track to track 0.102, other pairs 0.152 to 0.3
spacing copperThickness2oz: track to track 0.203, other pairs 0.152 to 0.3
track width copperThickness1oz (default): min 0.127, default 0.254, max 2.54
track width copperThickness2oz: min 0.203, default 0.254, max 2.54
differential pair differentialPair (default): width min 0.127, default 0.254, max 2.54; gap min 0.152, default 0.152
via viaSize (default): diameter min 0.5, default 0.61, max 10; hole min 0.3, default 0.305, max 6.3

## Placement (name value [footprint] x y rotation side)
32Mhz  32MHz  [CRYSTAL-SMD_4P-L3.2-W2.5-BL]  37.28 49.17 0 top
ANTSWIGPIO  ZX-XH2.54-6PZZ  [CONN-TH_6P-P2.50_ZX-XH2.54-6PZZ]  66.31 41.03 90 top
BOOT  PZ254V-11-03P  [HDR-TH_3P-P2.54-V-M]  38.38 10.92 0 top
C1  4.7nF  [C0603]  41.14 37.68 90 top
C2  100nF  [C0603]  43.26 37.76 90 top
C3  100nF  [C0603]  48.35 38.56 0 top
C4  4.7uF  [C0603]  48.34 36.86 180 top
C9  220nF  [C0603]  51.75 37.82 90 top
C10  1uF  [C0603]  54.52 42.16 180 top
C11  1uF  [C0603]  54.59 52.25 90 top
C12  1uF  [C0603]  38.07 53.23 270 top
C13  0.3pF  [C0402]  46.73 52.26 90 top
C14  0.8pF  [C0402]  47.97 50.38 180 top
C15  1.5pF  [C0402]  47.97 54.3 180 top
C16  0.8pF  [C0402]  46.88 58.13 0 top
C17  20pF  [C0402]  47.42 60.04 90 top
C18  10pF  [C0603]  37.29 39.91 270 top
C19  10pF  [C0603]  37.16 43.85 270 top
C20  1uF  [C0603]  49.23 27.02 270 top
C21  1uF  [C0603]  55.32 26.82 270 top
C22  1uF  [C0603]  61.17 26.87 270 top
C23  1uF  [C0603]  37.79 15.71 90 top
C24  1uF  [C0603]  33.59 20.03 90 top
C25  100nF  [C0603]  39.62 15.67 90 top
C26  100nF  [C0603]  35.53 20.01 90 top
C27  0.1uF 0603  [C0603]  72.44 7.49 180 top
C28  0.1uF 0603  [C0603]  72.44 5.7 180 top
C30  0.1uF 0603  [C0603]  63.85 14.62 180 top
C31  100nF  [C0603]  13.41 16.71 90 top
C32  100nF  [C0603]  16.08 16.78 90 top
C35  1uF  [C0603]  19.72 9.55 270 top
C36  12pF  [C0603]  19.16 20.37 0 top
C37  12pF  [C0603]  23.28 20.31 180 top
CH340N  CH340N  [SOP-8_L4.9-W3.9-P1.27-LS6.0-BL]  68.35 11.92 0 top
esp32_32khz  32.768kHz  [OSC-SMD_L3.2-W1.5]  21.22 17.68 0 top
ESP32_BOOT  TS-1101-C-W  [SW-SMD_L6.0-W3.3-LS8.0]  29.03 8.37 270 top
ESP32_RST  TS-1101-C-W  [SW-SMD_L6.0-W3.3-LS8.0]  23.54 8.2 270 top
ESP32_UART  PZ254V-11-04P  [HDR-TH_4P-P2.54-V-M]  12.77 4.35 180 top
ESP32JTAG  PZ254V-11-04P  [HDR-TH_4P-P2.54-V-M]  12.89 10.09 0 top
F1  nSMD010  [F1206]  43.16 16.99 180 top
KEY1_PA11  TS-1101-C-W  [SW-SMD_L6.0-W3.3-LS8.0]  57.99 23.4 270 top
KEY2_PA9  TS-1101-C-W  [SW-SMD_L6.0-W3.3-LS8.0]  63.83 23.4 270 top
L1  22nH  [IND-SMD_L1.6-W0.8-1]  45.99 37.69 90 top
L2  10uH  [L0805]  47.71 34.58 0 top
L3  2.4nH  [L0402]  48.03 52.27 90 top
L4  3.3nH  [L0402]  47.44 56.27 90 top
LDO1  ME6211C33M5G-N  [SOT-23-5_L3.0-W1.7-P0.95-LS2.8-BL]  38.63 19.37 0 top
LED_PB5  YLED0805R  [LED0805-RD]  42.65 28.61 270 top
MCU  STM32WB09KEV7TR  [VFQFPN-32_L5.0-W5.0-P0.50-TL-EP3.7]  48.16 45.18 180 top
POWER  YLED0805R  [LED0805-RD]  46.25 28.61 270 top
R1  10kΩ  [R0603]  52.65 29.75 180 top
R2  10kΩ  [R0603]  58.75 29.75 180 top
R3  510Ω  [R0603]  46.25 24.42 270 top
R5  510Ω  [R0603]  42.73 24.43 90 top
R6  10kΩ  [R0603]  64.6 29.75 180 top
R8  4.7kΩ  [R0603]  32.19 29.63 0 top
R9  4.7kΩ  [R0603]  25.78 43.5 90 top
R10  10kΩ  [R0603]  22.52 14.04 0 top
R11  10kΩ  [R0603]  31.66 11.82 90 top
RF2  KH-SMA-K513-G  [ANT-TH_KH-SMA-K513-G]  47.43 67.15 270 top
RSTN  TS-1101-C-W  [SW-SMD_L6.0-W3.3-LS8.0]  51.9 23.66 270 top
SCREW1  -  [M2螺丝]  76 67.33 0 top
SCREW2  -  [M2螺丝]  4.09 4.5 0 top
SCREW3  -  [M2螺丝]  4.68 67.76 0 top
SCREW4  -  [M2螺丝]  77.26 3.5 0 top
STLINK  PZ254V-11-04P  [HDR-TH_4P-P2.54-V-M]  39.63 6.85 0 top
U23  DB301V-3.5-2P-GN-S  [CONN-TH_DB301V-3.5-2P-GN]  66.81 4.23 0 top
U25  ESP32-S3-WROOM-1-N16R8  [WIRELM-SMD_ESP32-S3-WROOM-1]  20.61 31.63 90 top
USART  PZ254V-11-04P  [HDR-TH_4P-P2.54-V-M]  39.69 2.63 0 top
USB  USB-231-ARY  [USB-A-TH_USB-231-ARY]  54.22 12.81 0 top
wb0_32khz  32.768kHz  [OSC-SMD_L3.2-W1.5]  34.64 41.81 270 top

## Footprints (pads in the part's own frame, mm; a bottom-side part is the same pattern mirrored in y, then rotated)
ANT-TH_KH-SMA-K513-G
  round 2.3 hole 1.3: 1(-2.54,-2.54) 2(-2.54,2.54) 3(2.54,2.54) 4(2.54,-2.54) 5(0,0)
C0402
  rect 0.79x0.54 smd: 1(-0.545,0) 2(0.545,0)
C0603
  rect 0.8x0.9 smd: 1(-0.7,0) 2(0.7,0)
CONN-TH_6P-P2.50_ZX-XH2.54-6PZZ
  rect 1.524x1.6 hole 1.1: 1(6.25,0)
  round 1.6 hole 1.1: 2(3.75,0) 3(1.25,0) 4(-1.25,0) 5(-3.75,0) 6(-6.25,0)
CONN-TH_DB301V-3.5-2P-GN
  round 1.8 hole 1.1: 1(-1.75,0) 2(1.75,0)
CRYSTAL-SMD_4P-L3.2-W2.5-BL
  rect 1.4x1.2 smd: 1(-1.1,-0.85) 2(1.1,-0.85) 3(1.1,0.85) 4(-1.1,0.85)
F1206
  rect 1.19x1.728 smd: 1(-1.445,0) 2(1.445,0)
HDR-TH_3P-P2.54-V-M
  rect 1.7x1.7 hole 1.1: 1(-2.54,0)
  round 1.7 hole 1.1: 2(0,0) 3(2.54,0)
HDR-TH_4P-P2.54-V-M
  rect 1.7x1.7 hole 1.1: 1(-3.81,0)
  round 1.7 hole 1.1: 2(-1.27,0) 3(1.27,0) 4(3.81,0)
IND-SMD_L1.6-W0.8-1
  rect 0.8x0.864 smd: 1(0.7,0) 2(-0.7,0)
L0402
  rect 0.79x0.54 smd: 1(-0.545,0) 2(0.545,0)
L0805
  rect 1.133x1.377 smd: 1(-0.966,0) 2(0.966,0)
LED0805-RD
  rect 1x1.25 smd: 1(-1.1,0) 2(1.1,0)
M2螺丝
  round 2 hole 2: 1(0,0)
OSC-SMD_L3.2-W1.5
  rect 1.05x1.7 smd: 1(-1.275,0) 2(1.275,0)
R0603
  rect 0.806x0.864 smd: 1(-0.753,0) 2(0.753,0)
SOP-8_L4.9-W3.9-P1.27-LS6.0-BL
  oval 0.63x1.865 smd: 1(-1.905,-2.683) 2(-0.635,-2.683) 3(0.635,-2.683) 4(1.905,-2.683) 5(1.905,2.683) 6(0.635,2.683) 7(-0.635,2.683) 8(-1.905,2.683)
SOT-23-5_L3.0-W1.7-P0.95-LS2.8-BL
  rect 0.49x1.157 smd: 1(-0.95,-1.153) 2(0,-1.153) 3(0.95,-1.153)
  rect 0.49x1.175 smd: 4(0.95,1.153) 5(-0.95,1.153)
SW-SMD_L6.0-W3.3-LS8.0
  rect 1.9x1.5 smd: 1(-4,0) 2(4,0)
USB-A-TH_USB-231-ARY
  round 1.6 hole 1: 1(-3.5,1.355) 2(-1,1.355) 3(1,1.355) 4(3.5,1.355)
  round 3.3 hole 2.5: 5(-6.57,-1.355) 6(6.57,-1.355)
VFQFPN-32_L5.0-W5.0-P0.50-TL-EP3.7
  rect 0.6x0.28 smd: 1(-2.4,1.75) 2(-2.4,1.25) 3(-2.4,0.75) 4(-2.4,0.25) 5(-2.4,-0.25) 6(-2.4,-0.75) 7(-2.4,-1.25) 8(-2.4,-1.75) 17(2.4,-1.75) 18(2.4,-1.25) 19(2.4,-0.75) 20(2.4,-0.25) 21(2.4,0.25) 22(2.4,0.75) 23(2.4,1.25) 24(2.4,1.75)
  rect 0.28x0.6 smd: 9(-1.75,-2.4) 10(-1.25,-2.4) 11(-0.75,-2.4) 12(-0.25,-2.4) 13(0.25,-2.4) 14(0.75,-2.4) 15(1.25,-2.4) 16(1.75,-2.4) 25(1.75,2.4) 26(1.25,2.4) 27(0.75,2.4) 28(0.25,2.4) 29(-0.25,2.4) 30(-0.75,2.4) 31(-1.25,2.4) 32(-1.75,2.4)
  rect 3.7x3.7 smd: 33(-0.001,0)
WIRELM-SMD_ESP32-S3-WROOM-1
  rect 1.5x0.9 smd: 1(-8.75,8.895) 2(-8.75,7.625) 3(-8.75,6.355) 4(-8.75,5.085) 5(-8.75,3.815) 6(-8.75,2.545) 7(-8.75,1.275) 8(-8.75,0.005) 9(-8.75,-1.265) 10(-8.75,-2.535) 11(-8.75,-3.805) 12(-8.75,-5.075) 13(-8.75,-6.345) 14(-8.75,-7.615) 27(8.75,-7.615) 28(8.75,-6.345) 29(8.75,-5.075) 30(8.75,-3.805) 31(8.75,-2.535) 32(8.75,-1.265) 33(8.75,0.005) 34(8.75,1.275) 35(8.75,2.545) 36(8.75,3.815) 37(8.75,5.085) 38(8.75,6.355) 39(8.75,7.625) 40(8.75,8.895)
  rect 0.9x1.5 smd: 15(-6.985,-8.895) 16(-5.715,-8.895) 17(-4.445,-8.895) 18(-3.175,-8.895) 19(-1.905,-8.895) 20(-0.635,-8.895) 21(0.635,-8.895) 22(1.905,-8.895) 23(3.175,-8.895) 24(4.445,-8.895) 25(5.715,-8.895) 26(6.985,-8.865)
  rect 0.9x0.9 smd: 41(-2.9,2.575) 41(-2.9,1.175) 41(-2.9,-0.225) 41(-1.5,2.575) 41(-1.5,1.175) 41(-1.5,-0.225) 41(-0.1,2.575) 41(-0.1,1.175) 41(-0.1,-0.225)

## Nets
As in the schematic, except:
GND: 32Mhz.2 32Mhz.4 ANTSWIGPIO.2 BOOT.3 C1.1 C2.1 C3.1 C4.2 C9.1 C10.1 C11.2 C12.1 C14.1 C15.1 C16.1 C18.2 C19.1 C20.2 C21.2 C22.2 C23.1 C24.1 C25.1 C26.1 C27.1 C28.1 C30.2 C31.1 C32.1 C35.2 C36.1 C37.1 CH340N.3 ESP32_BOOT.2 ESP32_RST.2 ESP32_UART.1 KEY1_PA11.2 KEY2_PA9.2 LDO1.2 MCU.26 MCU.33 POWER.1 RF2.1 RF2.2 RF2.3 RF2.4 RSTN.2 SCREW1.1 SCREW2.1 SCREW3.1 SCREW4.1 STLINK.4 U23.2 U25.1 U25.40 U25.41 USART.4 USB.4 USB.5 USB.6
VCC: ANTSWIGPIO.1 BOOT.1 C1.2 C2.2 C10.2 C11.1 C12.2 C24.2 C26.2 C31.2 C32.2 ESP32_UART.4 LDO1.5 MCU.13 MCU.15 MCU.24 MCU.32 R1.1 R2.1 R3.2 R5.1 R6.1 R8.2 R9.2 R10.1 R11.1 STLINK.1 U25.2 USART.1
ANT_ID_1/PB1: ANTSWIGPIO.3 MCU.3
ANT_ID_2/PB2: ANTSWIGPIO.4 MCU.2
ANT_ID_3/PB3: ANTSWIGPIO.5 MCU.1
ANT_ID_4/PB4: ANTSWIGPIO.6 MCU.31
PB5: LED_PB5.1 MCU.30
$1N2801: LED_PB5.2 R5.2

Pads without a net: CH340N 4; LDO1 4; MCU 8 9 18 22; U25 4 5 6 7 10 11 12 13 14 16 17 18 19 20 21 22 23 24 25 26 28 29 30 31 39

## Via types
v1: diameter 0.61, hole 0.305, Top Layer to Bottom Layer, 151 vias

## Routing (per net, layer and track width the routed paths; a pad name or vN(x,y) marks a point on that pad's centre or on a via; arc(x,y) is an arc through that point)
+5VIN: length 42.5
  Top Layer w0.5: F1.1 47.43,14.17 USB.1 60.65,4.23 U23.1 66.53,5.7 C28.2 71.75,7.49 C27.2 71.74,13.12 CH340N.5
+5VOUT: length 8.8
  Top Layer w0.254: 37.69,16.52 C23.2
  Top Layer w0.3: C23.2 38.47,17.09 38.87,17.09 39.59,17.81 LDO1.3
  Top Layer w0.5: LDO1.1 37.69,16.52 ; C23.2 37.84,16.37 C25.2 41.1,16.37 41.72,16.99
GND: length 13
  Top Layer w0.254: C4.2 v1(47.66,36.87) v1(47.66,38.56) 46.91,39.31 MCU.26 ; C35.2 23.54,5.03 ESP32_RST.2 ; 51.9,20.22 RSTN.2
  vias: v1(6.83,64.28) v1(6.95,15.98) v1(7,19.68) v1(7.64,52.87) v1(7.64,48.7) v1(12.79,15.32) v1(13.62,52.86) v1(13.66,48.7) v1(17.75,20.37) v1(18.03,31.53) v1(18.03,30.13) v1(18.03,28.73) v1(19.43,31.53) v1(19.43,30.13) v1(19.43,28.73) v1(20.83,31.53) v1(20.83,30.13) v1(20.83,28.73) v1(24.69,20.3) v1(30.28,60.59) v1(31.21,59) v1(32.09,48.55) v1(32.44,41.43) v1(33.12,50.66) v1(33.59,18.64) v1(33.64,60.59) v1(33.87,16.64) v1(33.87,15.55) v1(34.57,53.42) v1(34.59,19.27) v1(34.78,16.64) v1(34.79,15.55) v1(35.52,59) v1(36.29,39.12) v1(36.47,53.42) v1(36.9,60.59) v1(37.71,27.4) v1(37.87,32.03) v1(38.07,55.02) v1(38.77,59) v1(39.73,60.59) v1(39.94,48.19) v1(40.23,53.23) v1(40.47,49.06) v1(40.87,59) v1(41.01,48.19) v1(41.75,32.12) v1(41.86,49.06) v1(42.03,53.23) v1(42.12,60.58) v1(42.35,70.39) v1(42.56,64.55) v1(42.5,48.19) v1(42.65,13.78) v1(42.88,67.28) v1(43.06,59) v1(43.38,62.19) v1(43.81,57.69) v1(43.97,60.45) v1(44.34,59.08) v1(44.34,13.28) v1(44.65,56.41) v1(44.76,55.46) v1(44.84,53.19) v1(45.12,62.11) v1(45.22,54.19) v1(45.41,52.31) v1(45.59,56.41) v1(45.59,55.41) v1(45.75,60.68) v1(45.71,58.13) v1(45.82,8.27) v1(47.16,46.18) v1(47.16,45.18) v1(47.16,44.18) v1(48.16,46.18) v1(48.16,45.18) v1(48.16,44.18) v1(48.94,60.68) v1(48.91,58.9) v1(48.91,57.46) v1(48.91,56.32) v1(49.13,54.3) v1(49.16,46.18) v1(49.16,45.18) v1(49.16,44.18) v1(49.38,55.53) v1(49.38,52.07) v1(49.76,50.44) v1(49.97,58.8) v1(50,57.03) v1(50.19,52.51) v1(51.06,60.56) v1(51.29,59.08) v1(51.63,50.46) v1(51.72,62.23) v1(51.75,36.16) v1(52.07,70.68) v1(52.07,67.57) v1(52.07,65.34) v1(52.32,63.59) v1(53.09,51.21) v1(53.78,59) v1(54.41,60.6) v1(56.62,59) v1(57.12,60.57) v1(57.53,40.06) v1(59.89,59) v1(60.13,60.5) v1(62.35,60.47) v1(63.73,59) v1(65.23,59) v1(65.93,60.5) v1(74.13,62.96)
VCC: length 327.1
  Top Layer w0.254: 59.51,25.06 60.89,23.68 63.62,23.68 65.35,25.41 R6.1 ; 59.51,25.06 R2.1 ; 59.51,25.06 58.1,23.66 55.68,23.66 53.41,25.92 ; v1(55.04,40.85) 53.82,42.07 C10.2 50.53,42.16 MCU.32 ; MCU.15 46.91,48.84 43.26,52.49 38.12,52.49 ; v1(25.87,45.03) 33.36,52.53 C12.2 ; 41.22,38.46 C2.2 43.45,38.46 44.28,39.28 44.28,41.95 MCU.24 ; v1(54.19,29.76) 54.17,29.75 R1.1 53.41,29.74 53.41,25.92 ; 53.41,25.92 51.16,23.67 R3.2 46.25,23.67 R5.1 35.94,23.67 34.44,22.18 ; R8.2 33.52,29.63 33.61,29.72 ; MCU.13 47.91,48.3 49.22,49.61 52.66,49.61 C11.1 ; 33.61,20.75 v1(33.61,21.35)
  Top Layer w0.3: v1(25.87,45.03) 25.78,44.94 R9.2
  Top Layer w0.5: ANTSWIGPIO.1 69.41,44.18 69.41,24.77 66.82,22.18 v1(33.91,22.18) ; v1(33.61,21.35) 33.61,31.61 40.39,38.38 C1.2 ; 31.06,18.19 31.28,18.19 33.06,16.42 33.06,12.24 31.88,11.07 R11.1 31.66,4.17 29.93,2.43 10.88,2.43 ESP32_UART.4 ; 31.06,18.19 31.06,18.99 32.79,20.73 C24.2 35.52,20.73 C26.2 37.5,20.71 LDO1.5 37.69,19.68 35.84,17.83 BOOT.1 35.84,6.86 STLINK.1 35.82,2.68 USART.1 ; 31.06,18.19 28.07,15.2 22.92,15.2 R10.1 20.07,15.74 18.25,15.74 16.5,17.48 C32.2 13.48,17.48 C31.2 12.95,17.86 12.95,22.52
  Bottom Layer w0.254: v1(54.19,29.76) 55.04,30.61 v1(55.04,40.85) 58.1,43.92 58.1,49.4 55.93,51.57 v1(55.3,51.57)
  Bottom Layer w0.3: v1(25.87,45.03) 26.75,45.03 27.91,43.88 27.91,41.52 32.06,37.36 32.06,22.87 v1(32.76,22.18) 32.79,22.18 v1(33.61,21.35)
  vias: v1(32.63,21.11)
ANT_ID_1/PB1: length 16.6
  Top Layer w0.254: MCU.3 57.71,44.43 59.85,42.28 ANTSWIGPIO.3
ANT_ID_2/PB2: length 17.5
  Top Layer w0.254: ANTSWIGPIO.4 60.44,39.78 56.3,43.93 MCU.2
ANT_ID_3/PB3: length 18.3
  Top Layer w0.254: MCU.1 56.01,43.43 60.78,38.66 64.94,38.66 ANTSWIGPIO.5
ANT_ID_4/PB4: length 20.7
  Top Layer w0.254: MCU.31 49.41,41.95 50.56,40.79 52.38,40.79 56.21,36.97 64.09,36.97 66.28,34.78 ANTSWIGPIO.6
D+: length 13.3
  Top Layer w0.254: CH340N.1 60.14,9.24 USB.3
D-: length 17.8
  Top Layer w0.254: USB.2 53.22,14.46 54.03,15.28 58.62,15.28 60.38,13.52 63.6,13.52 66.68,10.45 66.7,10.45 67.72,9.42 CH340N.2
EN: length 20.9
  Top Layer w0.254: C35.1 21.59,10.25 ESP32_RST.1 23.54,13.77 R10.2 v1(23.9,14.04) ; 14.25,22.85 14.25,22.19 v1(18.45,17.98)
  Bottom Layer w0.254: v1(23.9,14.04) 19.96,17.98 v1(18.45,17.98)
ESP32SCL: length 37.6
  Top Layer w0.254: MCU.23 44.49,43.93 v1(38.44,37.87) 34.09,37.87 v1(29.41,42.55) 15.12,42.55 14.25,41.68 U25.38
ESP32SDA: length 36.3
  Top Layer w0.254: U25.15 30.2,24.65 31.22,25.67 v1(31.22,39.41) ; v1(32.25,45.92) 45.75,45.92 MCU.19
  Bottom Layer w0.254: v1(31.22,39.41) 31.22,44.89 v1(32.25,45.92)
IO0: length 32.1
  Top Layer w0.254: 28.19,40.52 28.19,39.13 v1(28.19,39.12) ; v1(31.63,13.74) 31.63,12.6 R11.2 31.46,12.37 ESP32_BOOT.1
  Bottom Layer w0.254: v1(31.63,13.74) 28.19,17.19 v1(28.19,39.12)
OSC32IN: length 12.1
  Top Layer w0.254: MCU.20 43.83,45.43 41.56,43.15 C19.2 37.1,43.09 wb0_32khz.1
OSC32OUT: length 12.9
  Top Layer w0.254: wb0_32khz.2 37.22,40.54 C18.1 39.65,40.61 43.96,44.93 MCU.21
OSCIN: length 10.2
  Top Layer w0.254: 36.18,48.32 37.32,47.18 45.5,47.18 MCU.17
OSCOUT: length 9
  Top Layer w0.254: MCU.16 43.96,50.02 32Mhz.3
PA1/USART1TX: length 81.1
  Top Layer w0.254: v1(69.01,16.24) 69.01,14.63 CH340N.6 ; v1(62.53,44.04) 60.15,46.43 MCU.7
  Bottom Layer w0.254: v1(62.53,44.04) 62.53,22.72 v1(69.01,16.24) 68.98,16.21 68.98,12.31 61.16,4.49 42.81,4.49 USART.3
PA2/SWDIO: length 56.6
  Top Layer w0.254: MCU.6 59.68,45.93 v1(60.46,45.14)
  Bottom Layer w0.254: v1(60.46,45.14) 60.46,27.32 45,11.86 45,10.95 STLINK.3
PA3/SWCLK: length 56.5
  Top Layer w0.254: v1(59.65,44.82) 59.04,45.43 MCU.5
  Bottom Layer w0.254: STLINK.2 41.12,9.61 41.76,9.61 59.65,27.49 v1(59.65,44.82)
PA9: length 37.9
  Top Layer w0.254: MCU.10 49.41,47.91 49.68,48.19 58.19,48.19 v1(59.57,49.57) ; C22.1 63.67,27.57 KEY2_PA9.1 63.84,27.41 R6.2 63.71,29.89 v1(63.71,31.91)
  Bottom Layer w0.254: v1(63.71,31.91) 63.71,45.43 v1(59.57,49.57)
PA10/BOOT: length 55.6
  Top Layer w0.254: v1(57.52,49.16) 56.91,48.54 49.53,48.54 48.91,47.92 MCU.11
  Bottom Layer w0.254: BOOT.2 44.75,17.3 44.75,31.4 57.52,44.16 v1(57.52,49.16)
PA11: length 37.4
  Top Layer w0.254: v1(58.74,50.06) 57.22,50.06 56.26,49.11 49.29,49.11 48.41,48.23 MCU.12 ; C21.1 57.88,27.52 KEY1_PA11.1 58,27.41 R2.2 57.99,29.76 v1(57.99,31.53)
  Bottom Layer w0.254: v1(58.74,50.06) 58.74,32.28 v1(57.99,31.53)
PB0/USART1RX: length 80.1
  Top Layer w0.254: CH340N.7 67.75,14.63 v1(67.75,16.26) ; MCU.4 58.72,44.93 59.4,44.24 60.65,44.24 v1(61.66,43.22)
  Bottom Layer w0.254: v1(61.66,43.22) 61.66,22.34 v1(67.75,16.26) 67.75,12.53 60.6,5.39 41.18,5.39 USART.2
PB5: length 15.9
  Top Layer w0.254: v1(49.19,41.11) 48.91,41.39 MCU.30 ; v1(42.62,30.44) 42.62,29.74 LED_PB5.1
  Bottom Layer w0.254: v1(42.62,30.44) 42.62,34.54 v1(49.19,41.11)
RF: length 5.3
  Top Layer w0.3: 47.41,47.6 47.41,50.37 C14.2 47.42,51.03 ; L3.1 48.03,51.63 47.42,51.03 ; 47.42,51.03 C13.1
RSTN: length 21.9
  Top Layer w0.254: C20.1 51.83,27.72 51.89,27.66 51.89,29.75 53.12,30.97 53.12,38.8 51.62,40.3 48.85,40.3 48.41,40.74 MCU.29
RX: length 48.8
  Top Layer w0.254: 16.76,40.52 16.76,41.75 v1(16.77,41.75)
  Bottom Layer w0.254: ESP32_UART.2 10.95,7.44 6.67,7.44 6.16,7.96 6.16,10.28 12.83,16.95 12.83,36.1 16.77,40.04 v1(16.77,41.75)
TCK: length 31.5
  Bottom Layer w0.254: ESP32JTAG.4 16.7,34.24 v1(21.91,39.44)
TDI: length 32.6
  Bottom Layer w0.254: ESP32JTAG.2 15.03,13.49 15.03,35.11 v1(19.36,39.44)
TDO: length 32
  Bottom Layer w0.254: ESP32JTAG.3 15.73,11.66 15.73,34.55 v1(20.62,39.44)
TMS: length 33.1
  Bottom Layer w0.254: v1(18.09,39.45) 14.19,35.55 14.19,15.2 ESP32JTAG.1
TX: length 46.8
  Top Layer w0.254: 15.49,40.52 v1(15.49,41.74)
  Bottom Layer w0.254: v1(15.49,41.74) 15.49,40.26 11.58,36.35 11.58,17.1 5.47,10.99 5.47,7.8 6.42,6.85 9,6.85 ESP32_UART.3
$1N1158: length 9
  Top Layer w0.254: MCU.27 47.41,40.21 C3.2 49.06,36.87 C4.1 49.04,34.95 L2.2
$1N1170: length 2.7
  Top Layer w0.254: L2.1 45.99,35.33 L1.2
$1N1172: length 4.6
  Top Layer w0.254: L1.1 45.99,41.25 46.41,41.66 MCU.25
$1N1239: length 6.8
  Top Layer w0.254: C9.2 50.33,39.94 48.7,39.94 47.91,40.73 MCU.28
$1N2129: length 2.7
  Top Layer w0.3: L4.2 47.44,58.12 C16.2 47.42,59.49 C17.1
$1N2134: length 4.1
  Top Layer w0.3: 47.42,53.49 C15.2 47.44,54.32 L4.1 ; 47.42,53.49 48.03,52.88 L3.2 ; 47.42,53.49 C13.2
$1N2136: length 6.6
  Top Layer w0.254: 47.5,67.15 47.42,67.06 C17.2
$1N2700: length 2.3
  Top Layer w0.254: 46.26,27.51 R3.1
$1N2801: length 2.4
  Top Layer w0.254: 42.65,27.51 42.65,25.26 R5.2
$1N5752: length 1.9
  Top Layer w0.254: CH340N.8 66.43,14.62 C30.1
$2N5390: length 5.5
  Top Layer w0.254: 22.49,17.68 22.58,17.78 C37.2 21.87,21.03 21.87,22.85
$2N5391: length 5.5
  Top Layer w0.254: 20.6,22.85 20.6,21.11 C36.2 19.94,20.29 esp32_32khz.1

## Copper pours and planes (outline as drawn; the poured copper is in the pictures)
GND on Top Layer: 37.67,48.85 43.76,48.85 43.76,47.57 37.67,47.57
GND on Top Layer: 0.26,71.79 9.83,71.79 9.83,60.54 0.26,60.54
GND on Top Layer: 70.26,71.79 80.66,71.79 80.66,60.17 70.26,60.17
GND on Top Layer: 44.47,61.23 44.5,61.2 44.5,52.14 46.94,49.7 46.94,49.5 48.53,49.5 50.5,51.47 50.5,61.2 50.4,61.3 50.32,61.23
GND on Top Layer: 39.79,72.05 46.16,72.05 46.16,60.1 39.79,60.1
GND on Top Layer: 0.06,61.49 80.93,61.49 80.93,0.11 0.06,0.11
GND on Top Layer: 34.37,51.25 36.9,51.25 36.9,49.4 34.37,49.4
GND on Top Layer: 48.79,72.05 52.73,72.05 52.73,59.55 48.79,59.55
GND on Bottom Layer: 0.26,71.79 9.83,71.79 9.83,60.54 0.26,60.54
GND on Bottom Layer: 0,61.29 80.87,61.29 80.87,0 0,0
GND on Bottom Layer: 39.85,71.66 46.07,71.66 46.07,60.13 39.85,60.13
GND on Bottom Layer: 70.35,71.79 80.66,71.79 80.66,60.51 70.35,60.51
GND on Bottom Layer: 48.81,72.05 52.62,72.05 52.62,60.28 48.81,60.28
VCC on Top Layer: 31.98,22.87 34.55,22.87 34.55,20.4 31.98,20.4
VCC on Bottom Layer: 32.04,22.87 34.3,22.87 34.3,20.16 32.04,20.16

## Text on the board
Bottom Silkscreen Layer: 蓝牙AOA定位基站主控v1.0 / created by 张旭阳
Top Silkscreen Layer: TX | RX | CLK | DIO | VCC | GND
